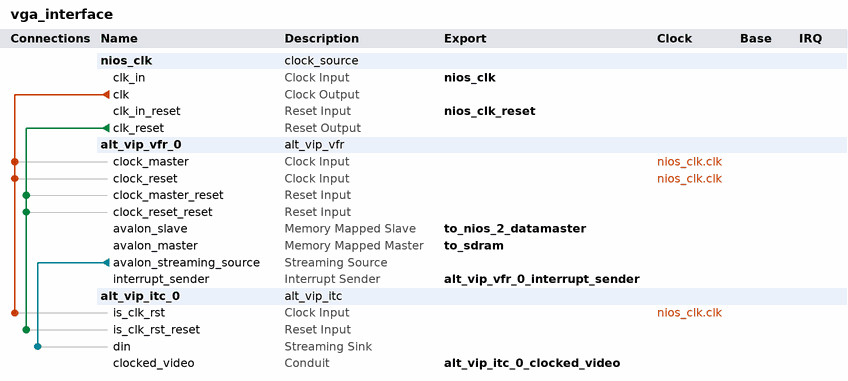
[diagram p0: system contents]
# Platform Designer (Qsys) system vga_interface, Cyclone II EP2C35F672C6
# Parameters at their usual value, and those the tool derives, are not listed.
package require -exact qsys 13.0
create_system vga_interface
set_project_property DEVICE_FAMILY {Cyclone II}
set_project_property DEVICE EP2C35F672C6

add_instance nios_clk clock_source 13.0
set_instance_parameter_value nios_clk clockFrequency 125000000
set_instance_parameter_value nios_clk clockFrequencyKnown false

add_instance alt_vip_vfr_0 alt_vip_vfr 13.0
set_instance_parameter_value alt_vip_vfr_0 NUMBER_OF_CHANNELS_IN_PARALLEL 3
set_instance_parameter_value alt_vip_vfr_0 MAX_IMAGE_WIDTH 800
set_instance_parameter_value alt_vip_vfr_0 MAX_IMAGE_HEIGHT 600
set_instance_parameter_value alt_vip_vfr_0 MEM_PORT_WIDTH 32

add_instance alt_vip_itc_0 alt_vip_itc 13.0
set_instance_parameter_value alt_vip_itc_0 NUMBER_OF_COLOUR_PLANES 3
set_instance_parameter_value alt_vip_itc_0 H_ACTIVE_PIXELS 800
set_instance_parameter_value alt_vip_itc_0 V_ACTIVE_LINES 600
set_instance_parameter_value alt_vip_itc_0 FIFO_DEPTH 512
set_instance_parameter_value alt_vip_itc_0 THRESHOLD 450
set_instance_parameter_value alt_vip_itc_0 H_SYNC_LENGTH 128
set_instance_parameter_value alt_vip_itc_0 H_FRONT_PORCH 40
set_instance_parameter_value alt_vip_itc_0 H_BACK_PORCH 88
set_instance_parameter_value alt_vip_itc_0 V_SYNC_LENGTH 4
set_instance_parameter_value alt_vip_itc_0 V_FRONT_PORCH 1
set_instance_parameter_value alt_vip_itc_0 V_BACK_PORCH 23

# connections
add_connection nios_clk.clk alt_vip_itc_0.is_clk_rst clock
add_connection nios_clk.clk alt_vip_vfr_0.clock_master clock
add_connection nios_clk.clk alt_vip_vfr_0.clock_reset clock
add_connection nios_clk.clk_reset alt_vip_itc_0.is_clk_rst_reset reset
add_connection nios_clk.clk_reset alt_vip_vfr_0.clock_master_reset reset
add_connection nios_clk.clk_reset alt_vip_vfr_0.clock_reset_reset reset
add_connection alt_vip_vfr_0.avalon_streaming_source alt_vip_itc_0.din avalon_streaming

# exported interfaces
add_interface alt_vip_itc_0_clocked_video conduit end
set_interface_property alt_vip_itc_0_clocked_video EXPORT_OF alt_vip_itc_0.clocked_video
add_interface alt_vip_vfr_0_interrupt_sender interrupt sender
set_interface_property alt_vip_vfr_0_interrupt_sender EXPORT_OF alt_vip_vfr_0.interrupt_sender
add_interface nios_clk clock sink
set_interface_property nios_clk EXPORT_OF nios_clk.clk_in
add_interface nios_clk_reset reset sink
set_interface_property nios_clk_reset EXPORT_OF nios_clk.clk_in_reset
add_interface to_nios_2_datamaster avalon slave
set_interface_property to_nios_2_datamaster EXPORT_OF alt_vip_vfr_0.avalon_slave
add_interface to_sdram avalon master
set_interface_property to_sdram EXPORT_OF alt_vip_vfr_0.avalon_master

set_interconnect_requirement {$system} qsys_mm.clockCrossingAdapter HANDSHAKE
set_interconnect_requirement {$system} qsys_mm.maxAdditionalLatency 1

save_system vga_interface.qsys
